# Altium project GMAX4651_MEZ.PrjPcb
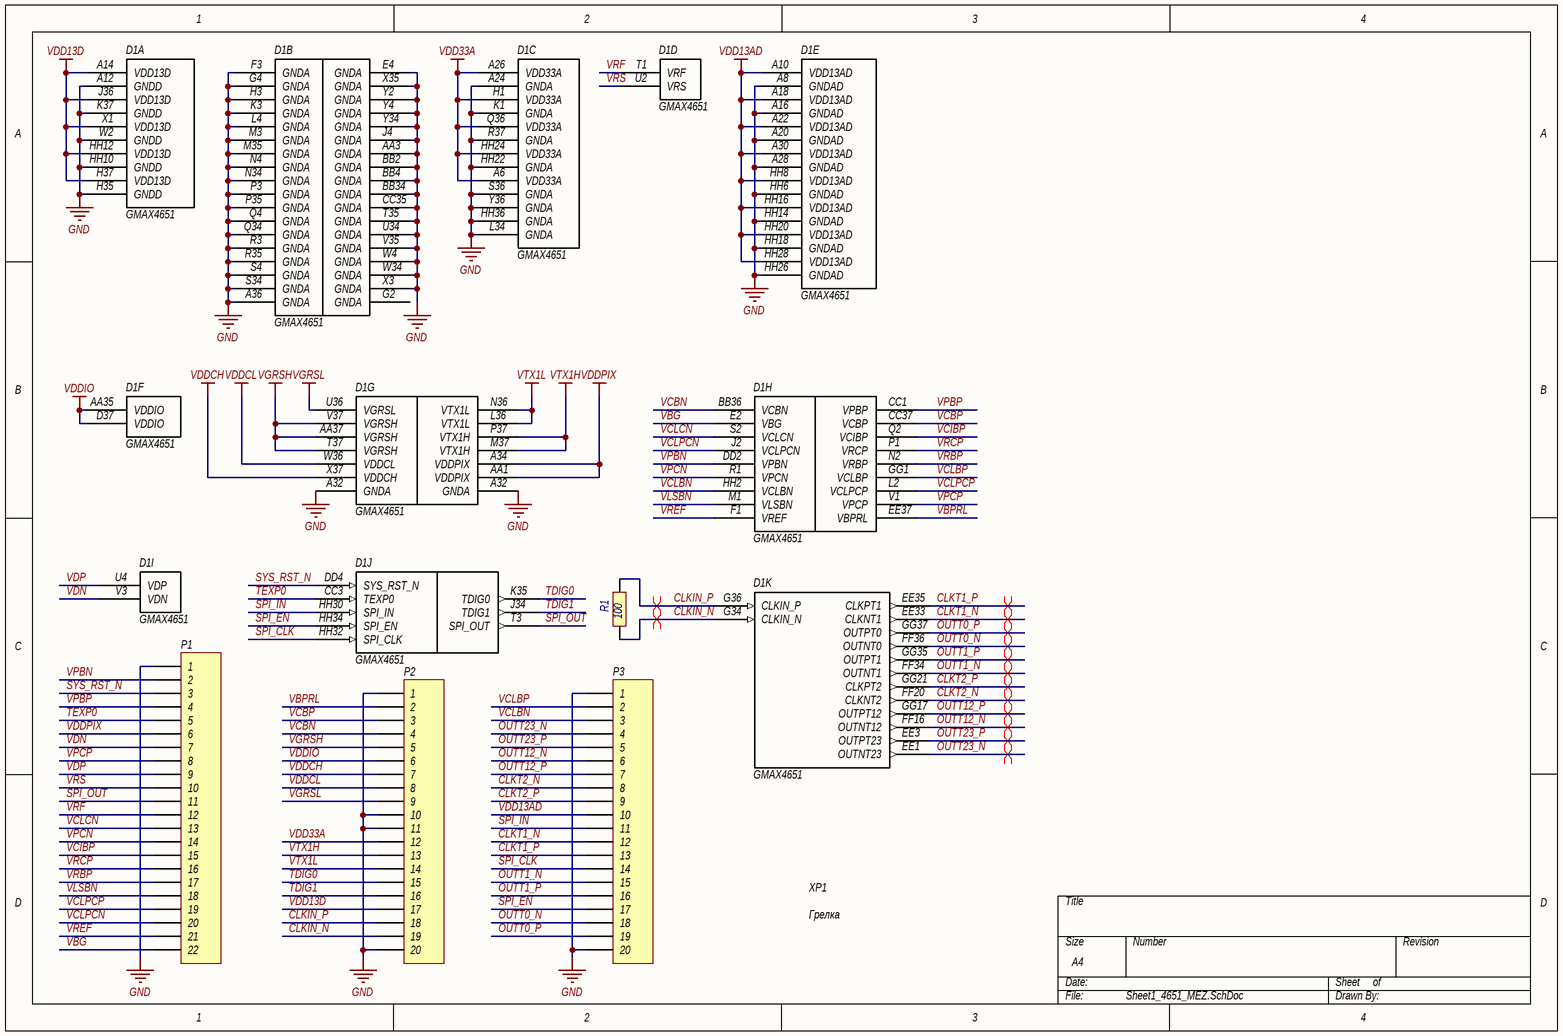
[diagram p0: Sheet1_4651_MEZ.SchDoc]
1 sheet, 6 parts. Net scope: global (net labels, ports and power ports of the same name join across sheets).
Board file: 4651_MEZ.PcbDoc

## Sheet Sheet1_4651_MEZ.SchDoc
size A4; SheetNumber: 1; SheetTotal: 1

### Parts
D1  GMAX4651  [GMAX4651]  (parts A,B,C,D,E,F,G,H,I,J,K of 11)
P1  Header 22  [HDR1X22]  (value not drawn)
P2  Header 20  [HDR1X20]  (value not drawn)
P3  Header 20  [HDR1X20]  (value not drawn)
R1  100  [RES]
XP1  Грелка  [Грелка]

### Nets
GND: D1.A8(GNDAD) D1.A12(GNDD) D1.A16(GNDAD) D1.A20(GNDAD) D1.A24(GNDA) D1.A28(GNDAD) D1.A32(GNDA) D1.A36(GNDA) D1.AA3(GNDA) D1.BB2(GNDA) D1.BB4(GNDA) D1.BB34(GNDA) D1.CC35(GNDA) D1.E4(GNDA) D1.F3(GNDA) D1.G4(GNDA) D1.H3(GNDA) D1.H35(GNDD) D1.HH6(GNDAD) D1.HH10(GNDD) D1.HH14(GNDAD) D1.HH18(GNDAD) D1.HH22(GNDA) D1.HH26(GNDAD) D1.HH36(GNDA) D1.J4(GNDA) D1.K1(GNDA) D1.K3(GNDA) D1.K37(GNDD) D1.L4(GNDA) D1.L34(GNDA) D1.M3(GNDA) D1.M35(GNDA) D1.N4(GNDA) D1.N34(GNDA) D1.P3(GNDA) D1.P35(GNDA) D1.Q4(GNDA) D1.Q34(GNDA) D1.R3(GNDA) D1.R35(GNDA) D1.R37(GNDA) D1.S4(GNDA) D1.S34(GNDA) D1.S36(GNDA) D1.T35(GNDA) D1.U34(GNDA) D1.V35(GNDA) D1.W2(GNDD) D1.W4(GNDA) D1.W34(GNDA) D1.X3(GNDA) D1.X35(GNDA) D1.Y2(GNDA) D1.Y4(GNDA) D1.Y34(GNDA) D1.Y36(GNDA) P1.1 P2.1 P2.10 P2.11 P2.20 P3.1 P3.20
VDD13AD: D1.A10(VDD13AD) D1.A18(VDD13AD) D1.A22(VDD13AD) D1.A30(VDD13AD) D1.HH8(VDD13AD) D1.HH16(VDD13AD) D1.HH20(VDD13AD) D1.HH28(VDD13AD) P3.10
VDD13D: D1.A14(VDD13D) D1.H37(VDD13D) D1.HH12(VDD13D) D1.J36(VDD13D) D1.X1(VDD13D) P2.17
VDD33A: D1.A6(VDD33A) D1.A26(VDD33A) D1.H1(VDD33A) D1.HH24(VDD33A) D1.Q36(VDD33A) P2.12
VDDCH: D1.X37(VDDCH) P2.7
VDDCL: D1.W36(VDDCL) P2.8
VDDIO: D1.AA35(VDDIO) D1.D37(VDDIO) P2.6
VDDPIX: D1.A34(VDDPIX) D1.AA1(VDDPIX) P1.6
VGRSH: D1.AA37(VGRSH) D1.T37(VGRSH) D1.V37(VGRSH) P2.5
VGRSL: D1.U36(VGRSL) P2.9
VTX1H: D1.M37(VTX1H) D1.P37(VTX1H) P2.13
VTX1L: D1.L36(VTX1L) D1.N36(VTX1L) P2.14
CLKIN_N: D1.G34(CLKIN_N) P2.19 R1.1
CLKIN_P: D1.G36(CLKIN_P) P2.18 R1.2
CLKT1_N: D1.EE33(CLKNT1) P3.12
CLKT1_P: D1.EE35(CLKPT1) P3.13
CLKT2_N: D1.FF20(CLKNT2) P3.8
CLKT2_P: D1.GG21(CLKPT2) P3.9
OUTT0_N: D1.FF36(OUTNT0) P3.18
OUTT0_P: D1.GG37(OUTPT0) P3.19
OUTT1_N: D1.FF34(OUTNT1) P3.15
OUTT1_P: D1.GG35(OUTPT1) P3.16
OUTT12_N: D1.FF16(OUTNT12) P3.6
OUTT12_P: D1.GG17(OUTPT12) P3.7
OUTT23_N: D1.EE1(OUTNT23) P3.4
OUTT23_P: D1.EE3(OUTPT23) P3.5
SPI_CLK: D1.HH32(SPI_CLK) P3.14
SPI_EN: D1.HH34(SPI_EN) P3.17
SPI_IN: D1.HH30(SPI_IN) P3.11
SPI_OUT: D1.T3(SPI_OUT) P1.11
SYS_RST_N: D1.DD4(SYS_RST_N) P1.3
TDIG0: D1.K35(TDIG0) P2.15
TDIG1: D1.J34(TDIG1) P2.16
TEXP0: D1.CC3(TEXP0) P1.5
VBG: D1.E2(VBG) P1.22
VBPRL: D1.EE37(VBPRL) P2.2
VCBN: D1.BB36(VCBN) P2.4
VCBP: D1.CC37(VCBP) P2.3
VCIBP: D1.Q2(VCIBP) P1.15
VCLBN: D1.HH2(VCLBN) P3.3
VCLBP: D1.GG1(VCLBP) P3.2
VCLCN: D1.S2(VCLCN) P1.13
VCLPCN: D1.J2(VCLPCN) P1.20
VCLPCP: D1.L2(VCLPCP) P1.19
VDN: D1.V3(VDN) P1.7
VDP: D1.U4(VDP) P1.9
VLSBN: D1.M1(VLSBN) P1.18
VPBN: D1.DD2(VPBN) P1.2
VPBP: D1.CC1(VPBP) P1.4
VPCN: D1.R1(VPCN) P1.14
VPCP: D1.V1(VPCP) P1.8
VRBP: D1.N2(VRBP) P1.17
VRCP: D1.P1(VRCP) P1.16
VREF: D1.F1(VREF) P1.21
VRF: D1.T1(VRF) P1.12
VRS: D1.U2(VRS) P1.10

Not connected (* = marked no-connect by the designer): D1 G2(GNDA)

### Layout directives
differential pair: CLKIN_N, CLKIN_P, CLKT1_N, CLKT1_P, CLKT2_N, CLKT2_P, OUTT0_N, OUTT0_P, OUTT1_N, OUTT1_P, OUTT12_N, OUTT12_P, OUTT23_N, OUTT23_P

### Library data of the parts
P1 = Header 22: Header, 22-Pin; LatestRevisionDate: 17-Jul-2002; LatestRevisionNote: Re-released for DXP Platform.; Publisher: Altium Limited
P2 P3 = Header 20: Header, 20-Pin; LatestRevisionDate: 17-Jul-2002; LatestRevisionNote: Re-released for DXP Platform.; Publisher: Altium Limited
R1 = RES